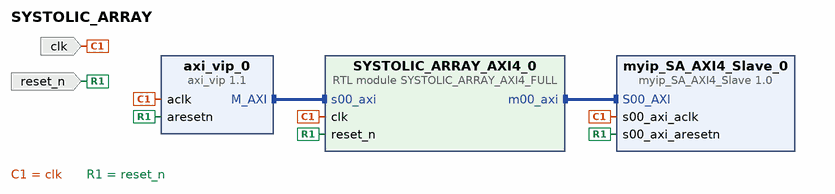
[diagram p0: block diagram of the top level]
# Vivado block design SYSTOLIC_ARRAY, xczu9eg-ffvb1156-2-e, Vivado 2020.2
create_bd_design SYSTOLIC_ARRAY

create_bd_port -dir I -type clk clk
set_property -dict {CONFIG.FREQ_HZ 166000000} [get_bd_ports clk]
create_bd_port -dir I -type rst reset_n

create_bd_cell -type ip -vlnv xilinx.com:ip:axi_vip:1.1 axi_vip_0
set_property -dict [list \
  CONFIG.ADDR_WIDTH 32 \
  CONFIG.DATA_WIDTH 32 \
  CONFIG.HAS_BRESP 1 \
  CONFIG.HAS_PROT 1 \
  CONFIG.HAS_RRESP 1 \
  CONFIG.HAS_WSTRB 1 \
  CONFIG.INTERFACE_MODE MASTER \
  CONFIG.PROTOCOL AXI4LITE \
  CONFIG.READ_WRITE_MODE READ_WRITE \
] [get_bd_cells axi_vip_0]
create_bd_cell -type ip -vlnv user.org:user:myip_SA_AXI4_Slave:1.0 myip_SA_AXI4_Slave_0
set_property -dict [list \
  CONFIG.INIT_FILE /home/hankyulkwon/vivado_project/systolic_array/systolic_array.srcs/sim_1/new/hex_mem_128b.mem \
] [get_bd_cells myip_SA_AXI4_Slave_0]
create_bd_cell -type module -reference SYSTOLIC_ARRAY_AXI4_FULL SYSTOLIC_ARRAY_AXI4_0
set_property -dict {CONFIG.C_S00_AXI_ADDR_WIDTH 32} [get_bd_cells SYSTOLIC_ARRAY_AXI4_0]

# ---- connections ----

connect_bd_intf_net [get_bd_intf_pins SYSTOLIC_ARRAY_AXI4_0/m00_axi] [get_bd_intf_pins myip_SA_AXI4_Slave_0/S00_AXI]
connect_bd_intf_net [get_bd_intf_pins axi_vip_0/M_AXI] [get_bd_intf_pins SYSTOLIC_ARRAY_AXI4_0/s00_axi]
connect_bd_net [get_bd_ports clk] [get_bd_pins axi_vip_0/aclk] [get_bd_pins myip_SA_AXI4_Slave_0/s00_axi_aclk] [get_bd_pins SYSTOLIC_ARRAY_AXI4_0/clk]
connect_bd_net [get_bd_ports reset_n] \
  [get_bd_pins axi_vip_0/aresetn] [get_bd_pins myip_SA_AXI4_Slave_0/s00_axi_aresetn] \
  [get_bd_pins SYSTOLIC_ARRAY_AXI4_0/reset_n]

# ---- address map ----
assign_bd_address -offset 0x44A00000 -range 4K -target_address_space [get_bd_addr_spaces axi_vip_0/Master_AXI] [get_bd_addr_segs SYSTOLIC_ARRAY_AXI4_0/s00_axi/reg0]
assign_bd_address -offset 0x76000000 -range 4K -target_address_space [get_bd_addr_spaces SYSTOLIC_ARRAY_AXI4_0/m00_axi] [get_bd_addr_segs myip_SA_AXI4_Slave_0/S00_AXI/S00_AXI_mem]

validate_bd_design
save_bd_design
